# Altium project BatteryManagementSystem.PrjPcb
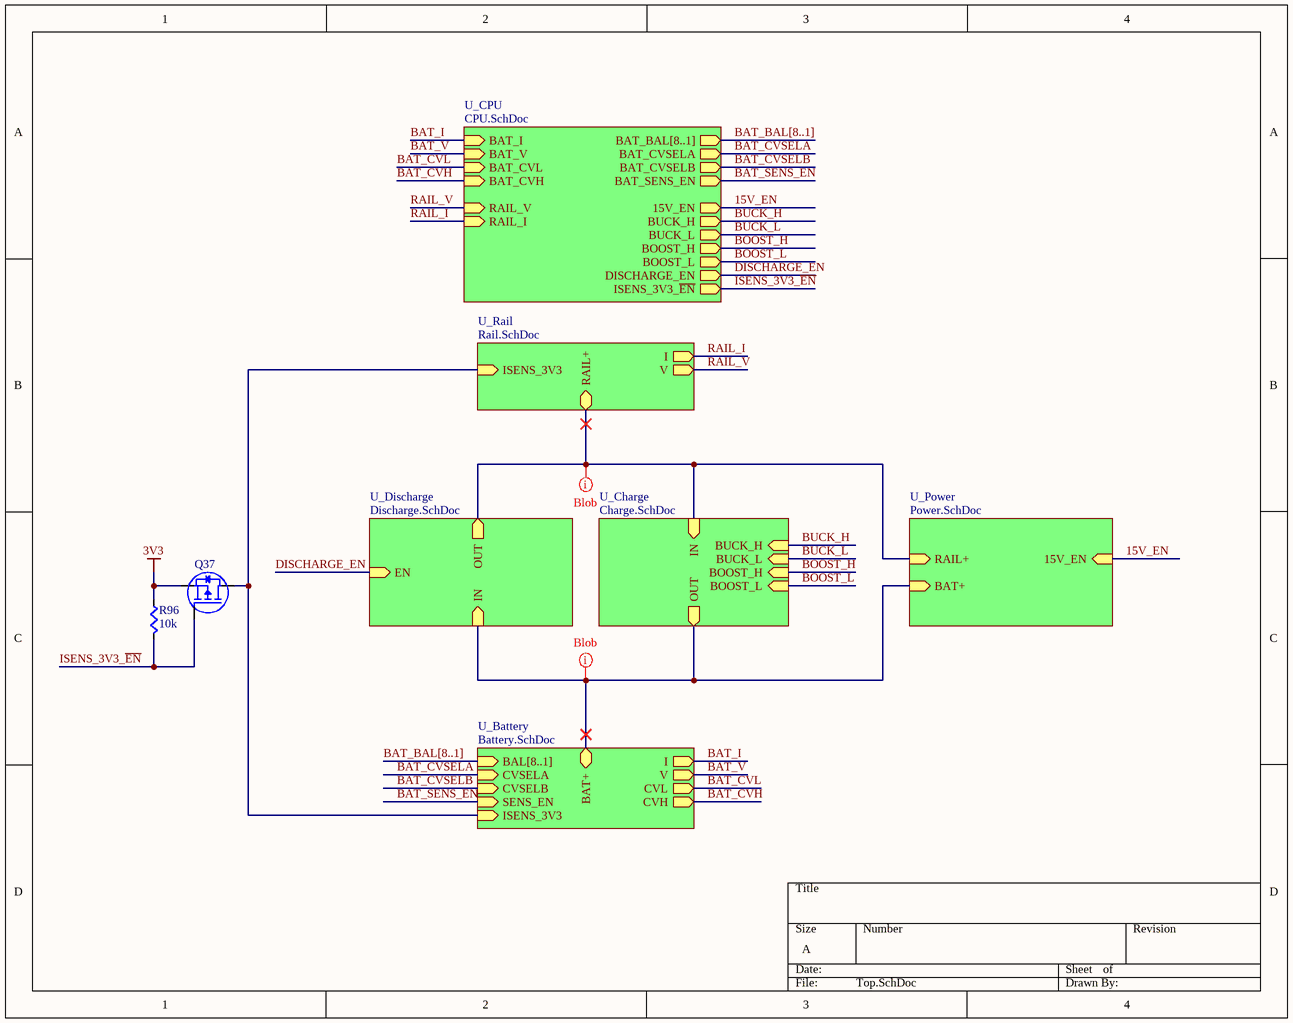
[diagram p0: Top.SchDoc]
7 sheets, 230 parts. Net scope: hierarchical (ports join the sheet entries above them; power ports are global).
Board files: BatteryManagementSystem.PcbDoc, BatteryManagementSystem2.PcbDoc
Sheets:
  Top.SchDoc
    U_Battery = Battery.SchDoc
    U_Rail = Rail.SchDoc
    U_Power = Power.SchDoc
    U_Discharge = Discharge.SchDoc
    U_Charge = Charge.SchDoc
    U_CPU = CPU.SchDoc

## Sheet Top.SchDoc
size A

### Parts
Q37  FDN5618P  [PowerSOT-3]  (value not drawn)
R96  value 10k  [RES0603]  (hidden comment: Res)

### Sub-sheets
U_Battery = Battery.SchDoc: V (out), BAT+ (bidir), I (out), BAL[8..1] (in), CVL (out), CVH (out), CVSELA (in), CVSELB (in), SENS_EN (in), ISENS_3V3 (in)
U_Charge = Charge.SchDoc: BOOST_L (in), BOOST_H (in), OUT (out), BUCK_L (in), BUCK_H (in), IN (in)
U_CPU = CPU.SchDoc: BAT_I (in), BAT_V (in), BAT_CVL (in), BAT_CVH (in), RAIL_V (in), RAIL_I (in), BAT_BAL[8..1] (out), BUCK_L (out), BUCK_H (out), BOOST_L (out), BOOST_H (out), BAT_CVSELA (out), BAT_CVSELB (out), DISCHARGE_EN (out), BAT_SENS_EN (out), 15V_EN (out), ISENS_3V3_~{EN} (out)
U_Discharge = Discharge.SchDoc: EN (in), IN (in), OUT (out)
U_Power = Power.SchDoc: 15V_EN (in), RAIL+ (in), BAT+ (in)
U_Rail = Rail.SchDoc: I (out), V (out), RAIL+ (bidir), ISENS_3V3 (in)

### Nets
3V3: Q37.S R96.1(A)
15V_EN: sheet U_Power/15V_EN, sheet U_CPU/15V_EN
BAT+: sheet U_Battery/BAT+, sheet U_Power/BAT+, sheet U_Discharge/IN, sheet U_Charge/OUT
BAT_CVH: sheet U_Battery/CVH, sheet U_CPU/BAT_CVH
BAT_CVL: sheet U_Battery/CVL, sheet U_CPU/BAT_CVL
BAT_CVSELA: sheet U_Battery/CVSELA, sheet U_CPU/BAT_CVSELA
BAT_CVSELB: sheet U_Battery/CVSELB, sheet U_CPU/BAT_CVSELB
BAT_I: sheet U_Battery/I, sheet U_CPU/BAT_I
BAT_SENS_EN: sheet U_Battery/SENS_EN, sheet U_CPU/BAT_SENS_EN
BAT_V: sheet U_Battery/V, sheet U_CPU/BAT_V
BOOST_H: sheet U_Charge/BOOST_H, sheet U_CPU/BOOST_H
BOOST_L: sheet U_Charge/BOOST_L, sheet U_CPU/BOOST_L
BUCK_H: sheet U_Charge/BUCK_H, sheet U_CPU/BUCK_H
BUCK_L: sheet U_Charge/BUCK_L, sheet U_CPU/BUCK_L
DISCHARGE_EN: sheet U_Discharge/EN, sheet U_CPU/DISCHARGE_EN
ISENS_3V3_~{EN}: Q37.G R96.2(B) ; sheet U_CPU/ISENS_3V3_~{EN}
RAIL+: sheet U_Rail/RAIL+, sheet U_Power/RAIL+, sheet U_Discharge/OUT, sheet U_Charge/IN
RAIL_I: sheet U_Rail/I, sheet U_CPU/RAIL_I
RAIL_V: sheet U_Rail/V, sheet U_CPU/RAIL_V
NetC1_1: Q37.D ; sheet U_Battery/ISENS_3V3, sheet U_Rail/ISENS_3V3

### Buses and harness runs
bus BAT_BAL[8..1] = sheet U_Battery/BAL[8..1]
bus BAT_BAL[8..1] = sheet U_CPU/BAT_BAL[8..1]

### Layout directives
net class Blob: BAT+, RAIL+

### Library data of the parts
Q37 = FDN5618P: 60V P-Channel Logic Level PowerTrench MOSFET; Supplier 1: Digi-Key; Supplier Part Number 1: FDN5618PCT-ND
R96 = Res: Supplier 1: Digi-Key; Supplier Part Number 1: RMCF0603JT10K0CT-ND

## Sheet Battery.SchDoc
size A3 portrait
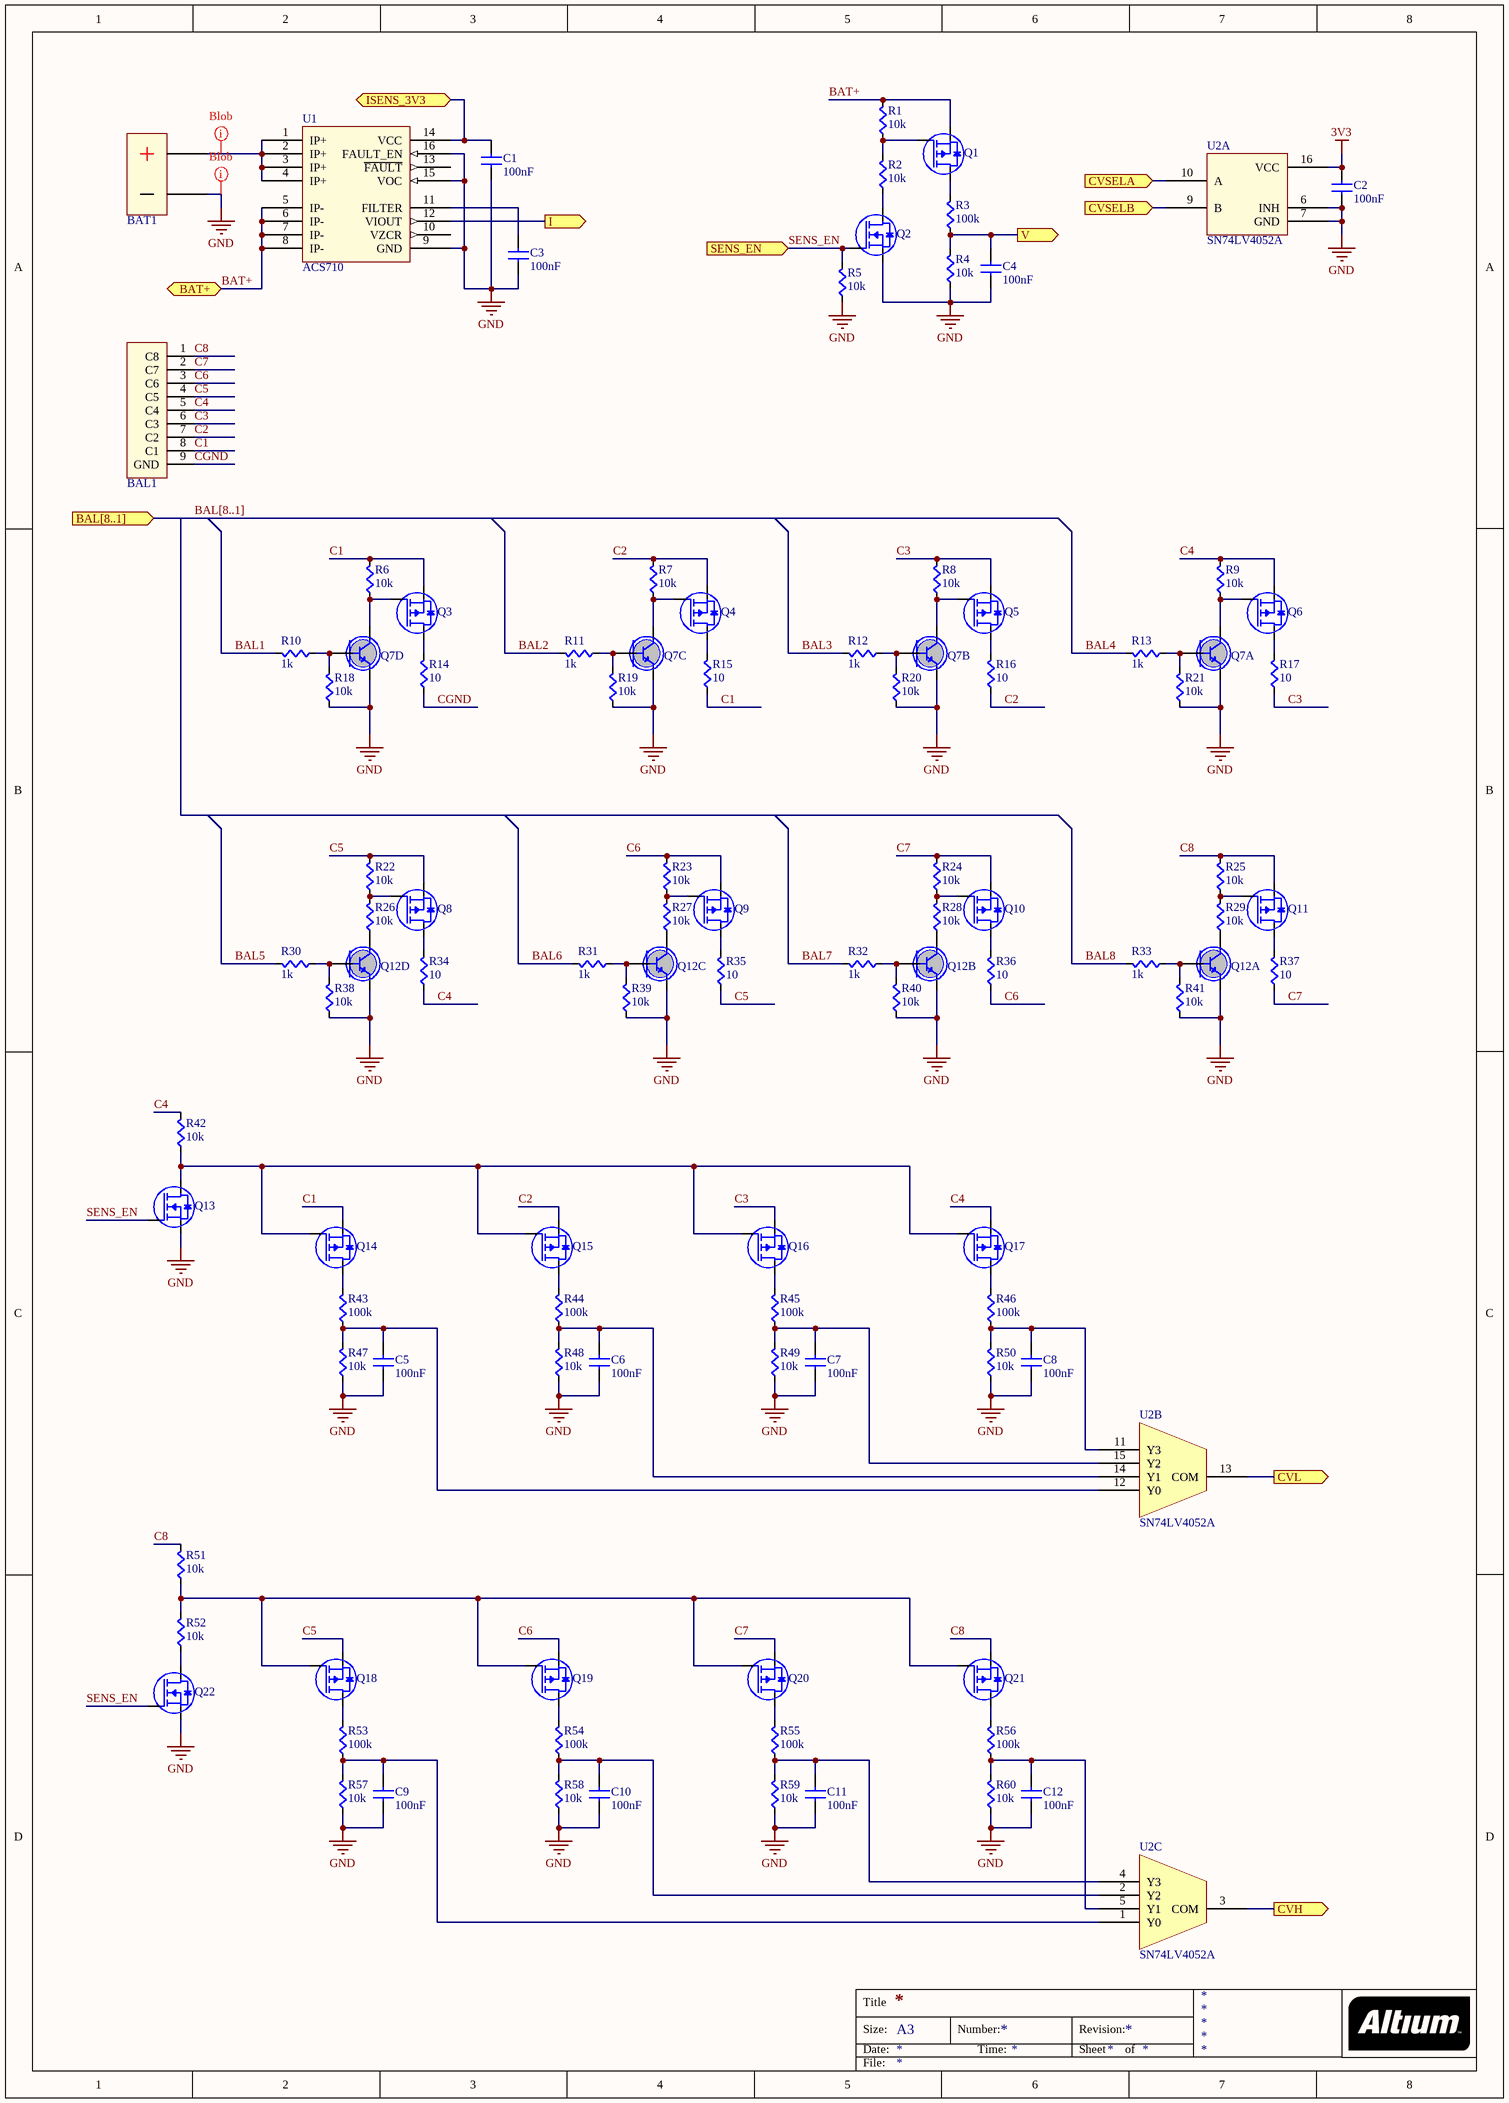
[diagram p1: Battery.SchDoc]

### Parts
BAL1  JST1x9  [JST1x9]  (value not drawn)
BAT1  BATWIRE  [BATWIRE12]  (value not drawn)
C1  value 100nF  [CAPC0603]  (hidden comment: Cap)
C2  value 100nF  [CAPC0603]  (hidden comment: Cap)
C3  value 100nF  [CAPC0603]  (hidden comment: Cap)
C4  value 100nF  [CAPC0603]  (hidden comment: Cap)
C5  value 100nF  [CAPC0603]  (hidden comment: Cap)
C6  value 100nF  [CAPC0603]  (hidden comment: Cap)
C7  value 100nF  [CAPC0603]  (hidden comment: Cap)
C8  value 100nF  [CAPC0603]  (hidden comment: Cap)
C9  value 100nF  [CAPC0603]  (hidden comment: Cap)
C10  value 100nF  [CAPC0603]  (hidden comment: Cap)
C11  value 100nF  [CAPC0603]  (hidden comment: Cap)
C12  value 100nF  [CAPC0603]  (hidden comment: Cap)
Q1  FDN5618P  [PowerSOT-3]  (value not drawn)
Q2  FDN5630  [PowerSOT-3]  (value not drawn)
Q3  FDN5618P  [PowerSOT-3]  (value not drawn)
Q4  FDN5618P  [PowerSOT-3]  (value not drawn)
Q5  FDN5618P  [PowerSOT-3]  (value not drawn)
Q6  FDN5618P  [PowerSOT-3]  (value not drawn)
Q7  MMPQ2222A  [MMPQ2222A]  (value not drawn)  (parts A,B,C,D of 4)
Q8  FDN5618P  [PowerSOT-3]  (value not drawn)
Q9  FDN5618P  [PowerSOT-3]  (value not drawn)
Q10  FDN5618P  [PowerSOT-3]  (value not drawn)
Q11  FDN5618P  [PowerSOT-3]  (value not drawn)
Q12  MMPQ2222A  [MMPQ2222A]  (value not drawn)  (parts A,B,C,D of 4)
Q13  FDN5630  [PowerSOT-3]  (value not drawn)
Q14  FDN5618P  [PowerSOT-3]  (value not drawn)
Q15  FDN5618P  [PowerSOT-3]  (value not drawn)
Q16  FDN5618P  [PowerSOT-3]  (value not drawn)
Q17  FDN5618P  [PowerSOT-3]  (value not drawn)
Q18  FDN5618P  [PowerSOT-3]  (value not drawn)
Q19  FDN5618P  [PowerSOT-3]  (value not drawn)
Q20  FDN5618P  [PowerSOT-3]  (value not drawn)
Q21  FDN5618P  [PowerSOT-3]  (value not drawn)
Q22  FDN5630  [PowerSOT-3]  (value not drawn)
R1  value 10k  [RES0603]  (hidden comment: Res)
R2  value 10k  [RES0603]  (hidden comment: Res)
R3  value 100k  [RES0603]  (hidden comment: Res)
R4  value 10k  [RES0603]  (hidden comment: Res)
R5  value 10k  [RES0603]  (hidden comment: Res)
R6  value 10k  [RES0603]  (hidden comment: Res)
R7  value 10k  [RES0603]  (hidden comment: Res)
R8  value 10k  [RES0603]  (hidden comment: Res)
R9  value 10k  [RES0603]  (hidden comment: Res)
R10  value 1k  [RES0603]  (hidden comment: Res)
R11  value 1k  [RES0603]  (hidden comment: Res)
R12  value 1k  [RES0603]  (hidden comment: Res)
R13  value 1k  [RES0603]  (hidden comment: Res)
R14  value 10  [FMP200]  (hidden comment: Res)
R15  value 10  [FMP200]  (hidden comment: Res)
R16  value 10  [FMP200]  (hidden comment: Res)
R17  value 10  [FMP200]  (hidden comment: Res)
R18  value 10k  [RES0603]  (hidden comment: Res)
R19  value 10k  [RES0603]  (hidden comment: Res)
R20  value 10k  [RES0603]  (hidden comment: Res)
R21  value 10k  [RES0603]  (hidden comment: Res)
R22  value 10k  [RES0603]  (hidden comment: Res)
R23  value 10k  [RES0603]  (hidden comment: Res)
R24  value 10k  [RES0603]  (hidden comment: Res)
R25  value 10k  [RES0603]  (hidden comment: Res)
R26  value 10k  [RES0603]  (hidden comment: Res)
R27  value 10k  [RES0603]  (hidden comment: Res)
R28  value 10k  [RES0603]  (hidden comment: Res)
R29  value 10k  [RES0603]  (hidden comment: Res)
R30  value 1k  [RES0603]  (hidden comment: Res)
R31  value 1k  [RES0603]  (hidden comment: Res)
R32  value 1k  [RES0603]  (hidden comment: Res)
R33  value 1k  [RES0603]  (hidden comment: Res)
R34  value 10  [FMP200]  (hidden comment: Res)
R35  value 10  [FMP200]  (hidden comment: Res)
R36  value 10  [FMP200]  (hidden comment: Res)
R37  value 10  [FMP200]  (hidden comment: Res)
R38  value 10k  [RES0603]  (hidden comment: Res)
R39  value 10k  [RES0603]  (hidden comment: Res)
R40  value 10k  [RES0603]  (hidden comment: Res)
R41  value 10k  [RES0603]  (hidden comment: Res)
R42  value 10k  [RES0603]  (hidden comment: Res)
R43  value 100k  [RES0603]  (hidden comment: Res)
R44  value 100k  [RES0603]  (hidden comment: Res)
R45  value 100k  [RES0603]  (hidden comment: Res)
R46  value 100k  [RES0603]  (hidden comment: Res)
R47  value 10k  [RES0603]  (hidden comment: Res)
R48  value 10k  [RES0603]  (hidden comment: Res)
R49  value 10k  [RES0603]  (hidden comment: Res)
R50  value 10k  [RES0603]  (hidden comment: Res)
R51  value 10k  [RES0603]  (hidden comment: Res)
R52  value 10k  [RES0603]  (hidden comment: Res)
R53  value 100k  [RES0603]  (hidden comment: Res)
R54  value 100k  [RES0603]  (hidden comment: Res)
R55  value 100k  [RES0603]  (hidden comment: Res)
R56  value 100k  [RES0603]  (hidden comment: Res)
R57  value 10k  [RES0603]  (hidden comment: Res)
R58  value 10k  [RES0603]  (hidden comment: Res)
R59  value 10k  [RES0603]  (hidden comment: Res)
R60  value 10k  [RES0603]  (hidden comment: Res)
U1  ACS710  [ACS710_NOPIN]
U2  SN74LV4052A  [SN74LV4052AD]  (parts A,B,C of 3)

### Ports
BAL[8..1] (in), BAT+ (bidir), CVH (out), CVL (out), CVSELA (in), CVSELB (in), I (out), ISENS_3V3, SENS_EN (in), V (out)

### Nets
3V3: C2.1(A) U2.16(VCC)
GND: BAT1.- C1.2(B) C2.2(B) C3.2(B) C4.2(B) C5.2(B) C6.2(B) C7.2(B) C8.2(B) C9.2(B) C10.2(B) C11.2(B) C12.2(B) Q2.S Q7.10(E4) Q7.12(E3) Q7.14(E2) Q7.16(E1) Q12.10(E4) Q12.12(E3) Q12.14(E2) Q12.16(E1) Q13.S Q22.S R4.2(B) R5.2(B) R18.2(B) R19.2(B) R20.2(B) R21.2(B) R38.2(B) R39.2(B) R40.2(B) R41.2(B) R47.2(B) R48.2(B) R49.2(B) R50.2(B) R57.2(B) R58.2(B) R59.2(B) R60.2(B) U1.9(GND) U1.15(VOC) U1.16(FAULT_EN) U2.6(INH) U2.7(GND)
BAL1: R10.1(A)
BAL2: R11.1(A)
BAL3: R12.1(A)
BAL4: R13.1(A)
BAL5: R30.1(A)
BAL6: R31.1(A)
BAL7: R32.1(A)
BAL8: R33.1(A)
BAT+: Q1.S R1.1(A) U1.5(IP-) U1.6(IP-) U1.7(IP-) U1.8(IP-) ; port BAT+
BAT_CVH: U2.3(COM) ; port CVH
BAT_CVL: U2.13(COM) ; port CVL
BAT_CVSELA: U2.10(A) ; port CVSELA
BAT_CVSELB: U2.9(B) ; port CVSELB
BAT_I: U1.12(VIOUT) ; port I
BAT_V: C4.1(A) R3.2(B) R4.1(A) ; port V
C1: BAL1.8(C1) Q3.S Q14.S R6.1(A) R15.2(B)
C2: BAL1.7(C2) Q4.S Q15.S R7.1(A) R16.2(B)
C3: BAL1.6(C3) Q5.S Q16.S R8.1(A) R17.2(B)
C4: BAL1.5(C4) Q6.S Q17.S R9.1(A) R34.2(B) R42.1(A)
C5: BAL1.4(C5) Q8.S Q18.S R22.1(A) R35.2(B)
C6: BAL1.3(C6) Q9.S Q19.S R23.1(A) R36.2(B)
C7: BAL1.2(C7) Q10.S Q20.S R24.1(A) R37.2(B)
C8: BAL1.1(C8) Q11.S Q21.S R25.1(A) R51.1(A)
CGND: BAL1.9(GND) R14.2(B)
SENS_EN: Q2.G Q13.G Q22.G R5.1(A) ; port SENS_EN  [project net BAT_SENS_EN]
NetBAT1_+: BAT1.+ U1.1(IP+) U1.2(IP+) U1.3(IP+) U1.4(IP+)
NetC1_1: C1.1(A) U1.14(VCC) ; port ISENS_3V3
NetC3_1: C3.1(A) U1.11(FILTER)
NetC5_1: C5.1(A) R43.2(B) R47.1(A) U2.12(Y0)
NetC6_1: C6.1(A) R44.2(B) R48.1(A) U2.14(Y1)
NetC7_1: C7.1(A) R45.2(B) R49.1(A) U2.15(Y2)
NetC8_1: C8.1(A) R46.2(B) R50.1(A) U2.11(Y3)
NetC9_1: C9.1(A) R53.2(B) R57.1(A) U2.1(Y0)
NetC10_1: C10.1(A) R54.2(B) R58.1(A) U2.2(Y2)
NetC11_1: C11.1(A) R55.2(B) R59.1(A) U2.4(Y3)
NetC12_1: C12.1(A) R56.2(B) R60.1(A) U2.5(Y1)
NetQ1_D: Q1.D R3.1(A)
NetQ1_G: Q1.G R1.2(B) R2.1(A)
NetQ2_D: Q2.D R2.2(B)
NetQ3_D: Q3.D R14.1(A)
NetQ3_G: Q3.G Q7.7(C4) R6.2(B)
NetQ4_D: Q4.D R15.1(A)
NetQ4_G: Q4.G Q7.5(C3) R7.2(B)
NetQ5_D: Q5.D R16.1(A)
NetQ5_G: Q5.G Q7.3(C2) R8.2(B)
NetQ6_D: Q6.D R17.1(A)
NetQ6_G: Q6.G Q7.1(C1) R9.2(B)
NetQ7_9: Q7.9(B4) R10.2(B) R18.1(A)
NetQ7_11: Q7.11(B3) R11.2(B) R19.1(A)
NetQ7_13: Q7.13(B2) R12.2(B) R20.1(A)
NetQ7_15: Q7.15(B1) R13.2(B) R21.1(A)
NetQ8_D: Q8.D R34.1(A)
NetQ8_G: Q8.G R22.2(B) R26.1(A)
NetQ9_D: Q9.D R35.1(A)
NetQ9_G: Q9.G R23.2(B) R27.1(A)
NetQ10_D: Q10.D R36.1(A)
NetQ10_G: Q10.G R24.2(B) R28.1(A)
NetQ11_D: Q11.D R37.1(A)
NetQ11_G: Q11.G R25.2(B) R29.1(A)
NetQ12_1: Q12.1(C1) R29.2(B)
NetQ12_3: Q12.3(C2) R28.2(B)
NetQ12_5: Q12.5(C3) R27.2(B)
NetQ12_7: Q12.7(C4) R26.2(B)
NetQ12_9: Q12.9(B4) R30.2(B) R38.1(A)
NetQ12_11: Q12.11(B3) R31.2(B) R39.1(A)
NetQ12_13: Q12.13(B2) R32.2(B) R40.1(A)
NetQ12_15: Q12.15(B1) R33.2(B) R41.1(A)
NetQ13_D: Q13.D Q14.G Q15.G Q16.G Q17.G R42.2(B)
NetQ14_D: Q14.D R43.1(A)
NetQ15_D: Q15.D R44.1(A)
NetQ16_D: Q16.D R45.1(A)
NetQ17_D: Q17.D R46.1(A)
NetQ18_D: Q18.D R53.1(A)
NetQ18_G: Q18.G Q19.G Q20.G Q21.G R51.2(B) R52.1(A)
NetQ19_D: Q19.D R54.1(A)
NetQ20_D: Q20.D R55.1(A)
NetQ21_D: Q21.D R56.1(A)
NetQ22_D: Q22.D R52.2(B)

Not connected (* = marked no-connect by the designer): U1 10(VZCR) 13(~{FAULT})

### Buses and harness runs
bus BAL[8..1] = port BAL[8..1]

### Layout directives
net class Blob: GND, NetBAT1_+

### Notes on the sheet
- Title
- Size:
- Date:
- A3
- Number:
- Time:
- Revision:
- Sheet
- of
- File:

### Library data of the parts
BAT1 = BATWIRE: Two large gauge leads soldered directly to the board.
Q1 Q3-Q6 Q8-Q11 Q14-Q21 = FDN5618P: as Q37 on sheet Top; Supplier 1: Digi-Key; Supplier Part Number 1: FDN5618PCT-ND
Q2 Q13 Q22 = FDN5630: 60V N-Channel PowerTrench MOSFET; Supplier 1: Digi-Key; Supplier Part Number 1: FDN5630CT-ND
Q7 Q12 = MMPQ2222A: Quad NPN General Purpose Amplifier; Supplier 1: Digi-Key; Supplier Part Number 1: MMPQ2222ACT-ND
U1 = ACS710: Current Sensor with Integrated Overcurrent Detection; Supplier 1: Digi-Key; Supplier Part Number 1: 620-1334-1-ND
U2 = SN74LV4052A: Dual 4-Channel Analog Multiplexers/Demultiplexers; Supplier 1: Digi-Key; Supplier Part Number 1: 296-16707-1-ND
BAL1 = JST1x9: Supplier 1: Digi-Key; Supplier Part Number 1: 455-2224-ND
C1-C12 = Cap: Supplier 1: Digi-Key; Supplier Part Number 1: 1276-1000-1-ND
R1-R60 = Res: Supplier 1: Digi-Key
  R1 R2 R6-R9 R18-R29 R38-R42 R51 R52: Supplier Part Number 1: RMCF0603JT10K0CT-ND
  R3 R43-R46 R53-R56: Supplier Part Number 1: RR08P100KDCT-ND
  R4 R5 R47-R50 R57-R60: Supplier Part Number 1: RR08P10.0KDCT-ND
  R10-R13 R30-R33: Supplier Part Number 1: RHM1.0KGCT-ND
  R14-R17 R34-R37: Supplier Part Number 1: 10ZCT-ND

## Sheet Rail.SchDoc
size A
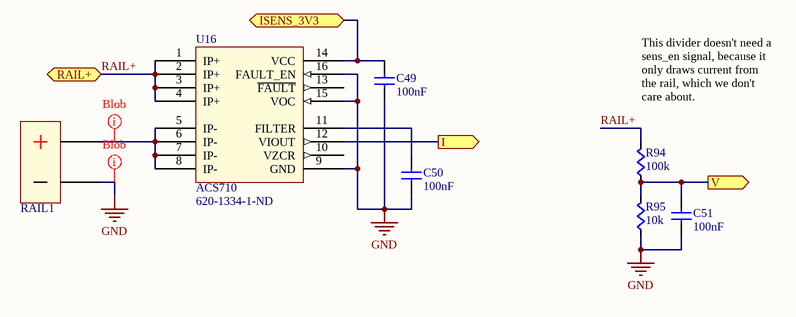
[diagram p2: Rail.SchDoc]

### Parts
C49  value 100nF  [CAPC0603]  (hidden comment: Cap)
C50  value 100nF  [CAPC0603]  (hidden comment: Cap)
C51  value 100nF  [CAPC0603]  (hidden comment: Cap)
R94  value 100k  [RES0603]  (hidden comment: Res)
R95  value 10k  [RES0603]  (hidden comment: Res)
RAIL1  BATWIRE  [BATWIRE12]  (value not drawn)
U16  ACS710  Supplier Part Number 1: 620-1334-1-ND  [ACS710]

### Ports
I (out), ISENS_3V3, RAIL+ (bidir), V (out)

### Nets
GND: C49.2(B) C50.2(B) C51.2(B) R95.2(B) RAIL1.- U16.9(GND) U16.15(VOC) U16.16(FAULT_EN)
RAIL+: R94.1(A) U16.1(IP+) U16.2(IP+) U16.3(IP+) U16.4(IP+) ; port RAIL+
RAIL_I: U16.12(VIOUT) ; port I
RAIL_V: C51.1(A) R94.2(B) R95.1(A) ; port V
NetC1_1: C49.1(A) U16.14(VCC) ; port ISENS_3V3
NetC50_1: C50.1(A) U16.11(FILTER)
NetRAIL1_+: RAIL1.+ U16.5(IP-) U16.6(IP-) U16.7(IP-) U16.8(IP-)

Not connected (* = marked no-connect by the designer): U16 10(VZCR) 13(~{FAULT})

### Layout directives
net class Blob: GND, NetRAIL1_+

### Notes on the sheet
- (near R94) This divider doesn't need a sens_en signal, because it only draws current from the rail, which we don't care about.

### Library data of the parts
RAIL1 = BATWIRE: as BAT1 on sheet Battery
U16 = ACS710: as U1 on sheet Battery; Supplier 1: Digi-Key
C49-C51 = Cap: Supplier 1: Digi-Key; Supplier Part Number 1: 1276-1000-1-ND
R94 R95 = Res: Supplier 1: Digi-Key
  R94: Supplier Part Number 1: RR08P100KDCT-ND
  R95: Supplier Part Number 1: RR08P10.0KDCT-ND

## Sheet Power.SchDoc
size A4
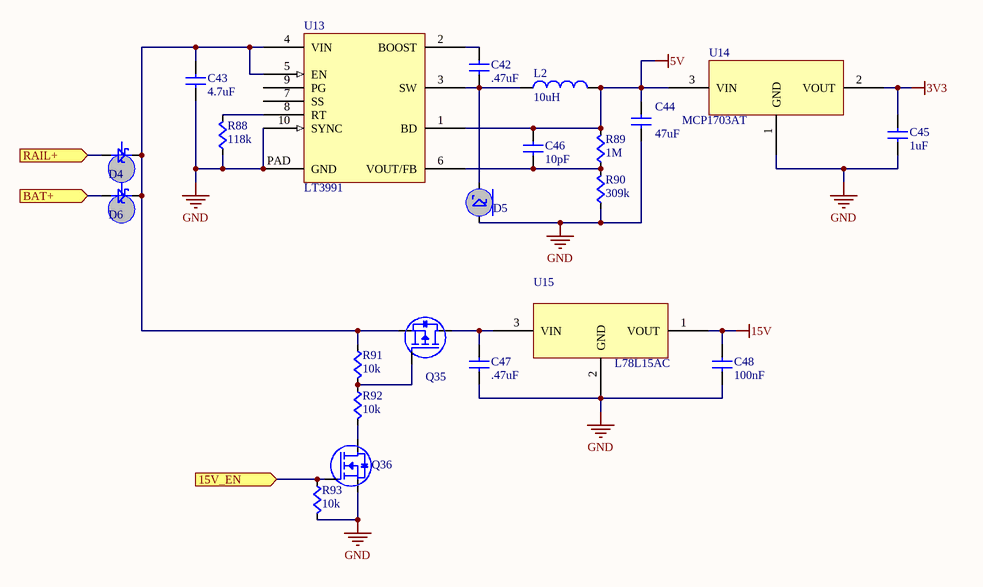
[diagram p3: Power.SchDoc]

### Parts
C42  value .47uF  [CAPC0603]  (hidden comment: Cap)
C43  value 4.7uF  [CAPC0805]  (hidden comment: Cap)
C44  value 47uF  [CAPC1206]  (hidden comment: Cap)
C45  value 1uF  [CAPC0603]  (hidden comment: Cap)
C46  value 10pF  [CAPC0603]  (hidden comment: Cap)
C47  value .47uF  [CAPC0603]  (hidden comment: Cap)
C48  value 100nF  [CAPC0603]  (hidden comment: Cap)
D4  DFLS160  [POWERDI123]  (value not drawn)
D5  DFLS160  [POWERDI123]  (value not drawn)
D6  DFLS160  [POWERDI123]  (value not drawn)
L2  Inductance: 10uH  [CDPH4D19F]  (hidden comment: Inductor)
Q35  FDN5618P  [PowerSOT-3]  (value not drawn)
Q36  FDN5630  [PowerSOT-3]  (value not drawn)
R88  value 118k  [RES0603]  (hidden comment: Res)
R89  value 1M  [RES0603]  (hidden comment: Res)
R90  value 309k  [RES0603]  (hidden comment: Res)
R91  value 10k  [RES0603]  (hidden comment: Res)
R92  value 10k  [RES0603]  (hidden comment: Res)
R93  value 10k  [RES0603]  (hidden comment: Res)
U13  LT3991  [LTS3991MSE]
U14  MCP1703AT  [MCP1703AT-xx02EMB]
U15  L78L15AC  [L78LxxAxUTR]

### Ports
15V_EN (in), BAT+ (in), RAIL+ (in)

### Nets
3V3: C45.1(A) U14.2(VOUT)
5V: C44.1(A) C46.2(B) L2.2(B) R89.1(A) U13.1(BD) U14.3(VIN)
15V: C48.1(A) U15.1(VOUT)
GND: C43.2(B) C44.2(B) C45.2(B) C47.2(B) C48.2(B) D5.A Q36.S R88.2(B) R90.2(B) R93.2(B) U13.10(SYNC) U13.PAD(GND) U14.1(GND) U15.2(GND)
15V_EN: Q36.G R93.1(A) ; port 15V_EN
BAT+: D6.A ; port BAT+
RAIL+: D4.A ; port RAIL+
NetC42_1: C42.1(A) U13.2(BOOST)
NetC42_2: C42.2(B) D5.C L2.1(A) U13.3(SW)
NetC43_1: C43.1(A) D4.C D6.C Q35.S R91.2(B) U13.4(VIN) U13.5(EN)
NetC46_1: C46.1(A) R89.2(B) R90.1(A) U13.6(VOUT/FB)
NetC47_1: C47.1(A) Q35.D U15.3(VIN)
NetQ35_G: Q35.G R91.1(A) R92.2(B)
NetQ36_D: Q36.D R92.1(A)
NetR88_1: R88.1(A) U13.8(RT)

Not connected (* = marked no-connect by the designer): U13 7(SS) 9(PG)

### Library data of the parts
D4-D6 = DFLS160: 1.0A Surface Mount Schottky Barrier Rectifier; Supplier 1: Digi-Key; Supplier Part Number 1: DFLS160DICT-ND
Q35 = FDN5618P: as Q37 on sheet Top; Supplier 1: Digi-Key; Supplier Part Number 1: FDN5618PCT-ND
Q36 = FDN5630: 60V N-Channel PowerTrench MOSFET; Supplier 1: Digi-Key; Supplier Part Number 1: FDN5630CT-ND
U13 = LT3991: 55V, 1.2A Step-Down Regulator with 2.8uA Quiescent Current; Supplier 1: Digi-Key; Supplier Part Number 1: LT3991EMSE#PBF-ND
U14 = MCP1703AT: 250 mA, 16V, Low Quiescent Current LDO Regulator; pin to pad: 2>3 3>2; Supplier 1: Digi-Key; Supplier Part Number 1: MCP1703AT-3302E/MBTR-ND
U15 = L78LxxAx: Positive Voltage Regulator; Supplier 1: Digi-Key; Supplier Part Number 1: 497-7279-1-ND
C42-C48 = Cap: Supplier 1: Digi-Key
  C42 C47: Supplier Part Number 1: 445-7465-1-ND
  C43: Supplier Part Number 1: 1276-1248-1-ND
  C44: Supplier Part Number 1: 399-5508-1-ND
  C45: Supplier Part Number 1: 1276-1041-1-ND
  C46: Supplier Part Number 1: 478-5769-1-ND
  C48: Supplier Part Number 1: 1276-1000-1-ND
L2 = Inductor: Supplier 1: Digi-Key; Supplier Part Number 1: 308-1311-1-ND
R88-R93 = Res: Supplier 1: Digi-Key
  R88: Supplier Part Number 1: RMCF0603FT118KCT-ND
  R89: Supplier Part Number 1: 541-1.0MAYCT-ND
  R90: Supplier Part Number 1: RR08P309KDCT-ND
  R91-R93: Supplier Part Number 1: RMCF0603JT10K0CT-ND

## Sheet Discharge.SchDoc
size A
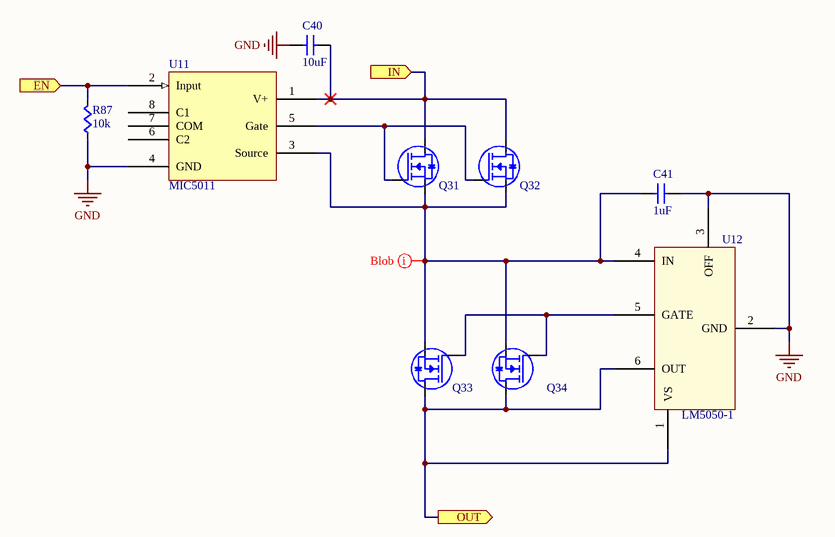
[diagram p4: Discharge.SchDoc]

### Parts
C40  value 10uF  [CAPC1206]  (hidden comment: Cap)
C41  value 1uF  [CAPC0805]  (hidden comment: Cap)
Q31  IRFB3306PbF  [TO-220AB Heatsink]  (value not drawn)
Q32  IRFB3306PbF  [TO-220AB Heatsink]  (value not drawn)
Q33  IRFB3306PbF  [TO-220AB Heatsink]  (value not drawn)
Q34  IRFB3306PbF  [TO-220AB Heatsink]  (value not drawn)
R87  value 10k  [RES0603]  (hidden comment: Res)
U11  MIC5011  [MIC5011]
U12  LM5050-1  [LM5050]

### Ports
EN (in), IN (in), OUT (out)

### Nets
GND: C40.1(A) C41.1(A) R87.2(B) U11.4(GND) U12.2(GND) U12.3(OFF)
BAT+: C40.2(B) Q31.D Q32.D U11.1(V+) ; port IN
DISCHARGE_EN: R87.1(A) U11.2(Input) ; port EN
RAIL+: Q33.D Q34.D U12.1(VS) U12.6(OUT) ; port OUT
NetC41_2: C41.2(B) Q31.S Q32.S Q33.S Q34.S U11.3(Source) U12.4(IN)
NetQ31_G: Q31.G Q32.G U11.5(Gate)
NetQ33_G: Q33.G Q34.G U12.5(GATE)

Not connected (* = marked no-connect by the designer): U11 6(C2) 7(COM) 8(C1)

### Layout directives
net class Blob: NetC41_2

### Library data of the parts
Q31-Q34 = IRFx3306PbF: HEXFET Power MOSFET; Heatsink: A10755-ND; Supplier 1: Digi-Key; Supplier Part Number 1: IRFB3306PBF-ND
U11 = MIC5011: Minimum Parts High- or Low-Side MOSFET Driver; Supplier 1: Digi-Key; Supplier Part Number 1: 576-1230-ND
U12 = LM5050: High-Side OR-ing FET Controller; Supplier 1: Digi-Key; Supplier Part Number 1: LM5050MK-1/NOPBCT-ND
C40 C41 = Cap: Supplier 1: Digi-Key
  C40: Supplier Part Number 1: 1276-2876-1-ND
  C41: Supplier Part Number 1: 1276-1029-1-ND
R87 = Res: Supplier 1: Digi-Key; Supplier Part Number 1: RMCF0603JT10K0CT-ND

## Sheet Charge.SchDoc
size A
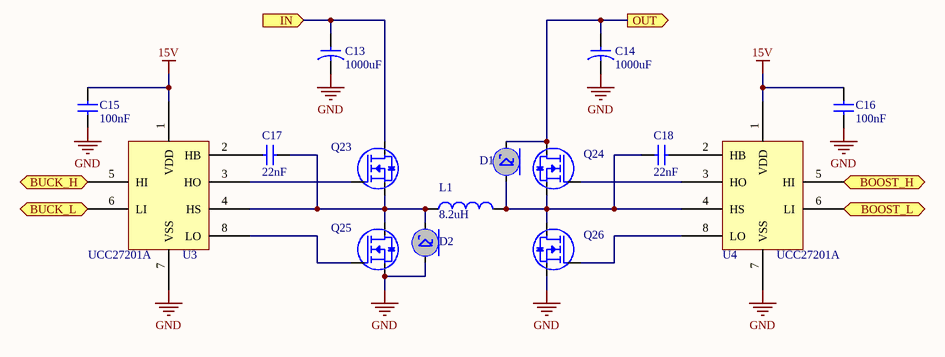
[diagram p5: Charge.SchDoc]

### Parts
C13  value 1000uF  [CAP1000uF]  (hidden comment: CapPol)
C14  value 1000uF  [CAP1000uF]  (hidden comment: CapPol)
C15  value 100nF  [CAPC0603]  (hidden comment: Cap)
C16  value 100nF  [CAPC0603]  (hidden comment: Cap)
C17  value 22nF  [CAPC0603]  (hidden comment: Cap)
C18  value 22nF  [CAPC0603]  (hidden comment: Cap)
D1  DFLS160  [POWERDI123]  (value not drawn)
D2  DFLS160  [POWERDI123]  (value not drawn)
L1  Inductance: 8.2uH  [IHLP-6767]  (hidden comment: Inductor)
Q23  IRFB3306PbF  [TO-220AB Heatsink]  (value not drawn)
Q24  IRFB3306PbF  [TO-220AB Heatsink]  (value not drawn)
Q25  IRFB3306PbF  [TO-220AB Heatsink]  (value not drawn)
Q26  IRFB3306PbF  [TO-220AB Heatsink]  (value not drawn)
U3  UCC27201A  [UCC27201A]
U4  UCC27201A  [UCC27201A]

### Ports
BOOST_H (in), BOOST_L (in), BUCK_H (in), BUCK_L (in), IN (in), OUT (out)

### Nets
15V: C15.1(A) C16.1(A) U3.1(VDD) U4.1(VDD)
GND: C13.2(B) C14.2(B) C15.2(B) C16.2(B) D2.A Q25.S Q26.S U3.7(VSS) U4.7(VSS)
BAT+: C14.1(A) D1.C Q24.D ; port OUT
BOOST_H: U4.5(HI) ; port BOOST_H
BOOST_L: U4.6(LI) ; port BOOST_L
BUCK_H: U3.5(HI) ; port BUCK_H
BUCK_L: U3.6(LI) ; port BUCK_L
RAIL+: C13.1(A) Q23.D ; port IN
NetC17_1: C17.1(A) D2.C L1.1(A) Q23.S Q25.D U3.4(HS)
NetC17_2: C17.2(B) U3.2(HB)
NetC18_1: C18.1(A) D1.A L1.2(B) Q24.S Q26.D U4.4(HS)
NetC18_2: C18.2(B) U4.2(HB)
NetQ23_G: Q23.G U3.3(HO)
NetQ24_G: Q24.G U4.3(HO)
NetQ25_G: Q25.G U3.8(LO)
NetQ26_G: Q26.G U4.8(LO)

### Library data of the parts
D1 D2 = DFLS160: as D4 on sheet Power; Supplier 1: Digi-Key; Supplier Part Number 1: DFLS160DICT-ND
Q23-Q26 = IRFx3306PbF: HEXFET Power MOSFET; Heatsink: A10755-ND; Supplier 1: Digi-Key; Supplier Part Number 1: IRFB3306PBF-ND
U3 U4 = UCC27201A: IC DVR HIGH/LOW SIDE 3A 8SOPWR; Supplier 1: Digi-Key; Supplier Part Number 1: 296-28428-1-ND
C13 C14 = CapPol: Supplier 1: Digi-Key; Supplier Part Number 1: 565-1618-ND
C15-C18 = Cap: Supplier 1: Digi-Key
  C15 C16: Supplier Part Number 1: 1276-1000-1-ND
  C17 C18: Supplier Part Number 1: 445-2275-1-ND
L1 = Inductor: Supplier 1: Digi-Key; Supplier Part Number 1: 541-1285-1-ND

## Sheet CPU.SchDoc
size A3
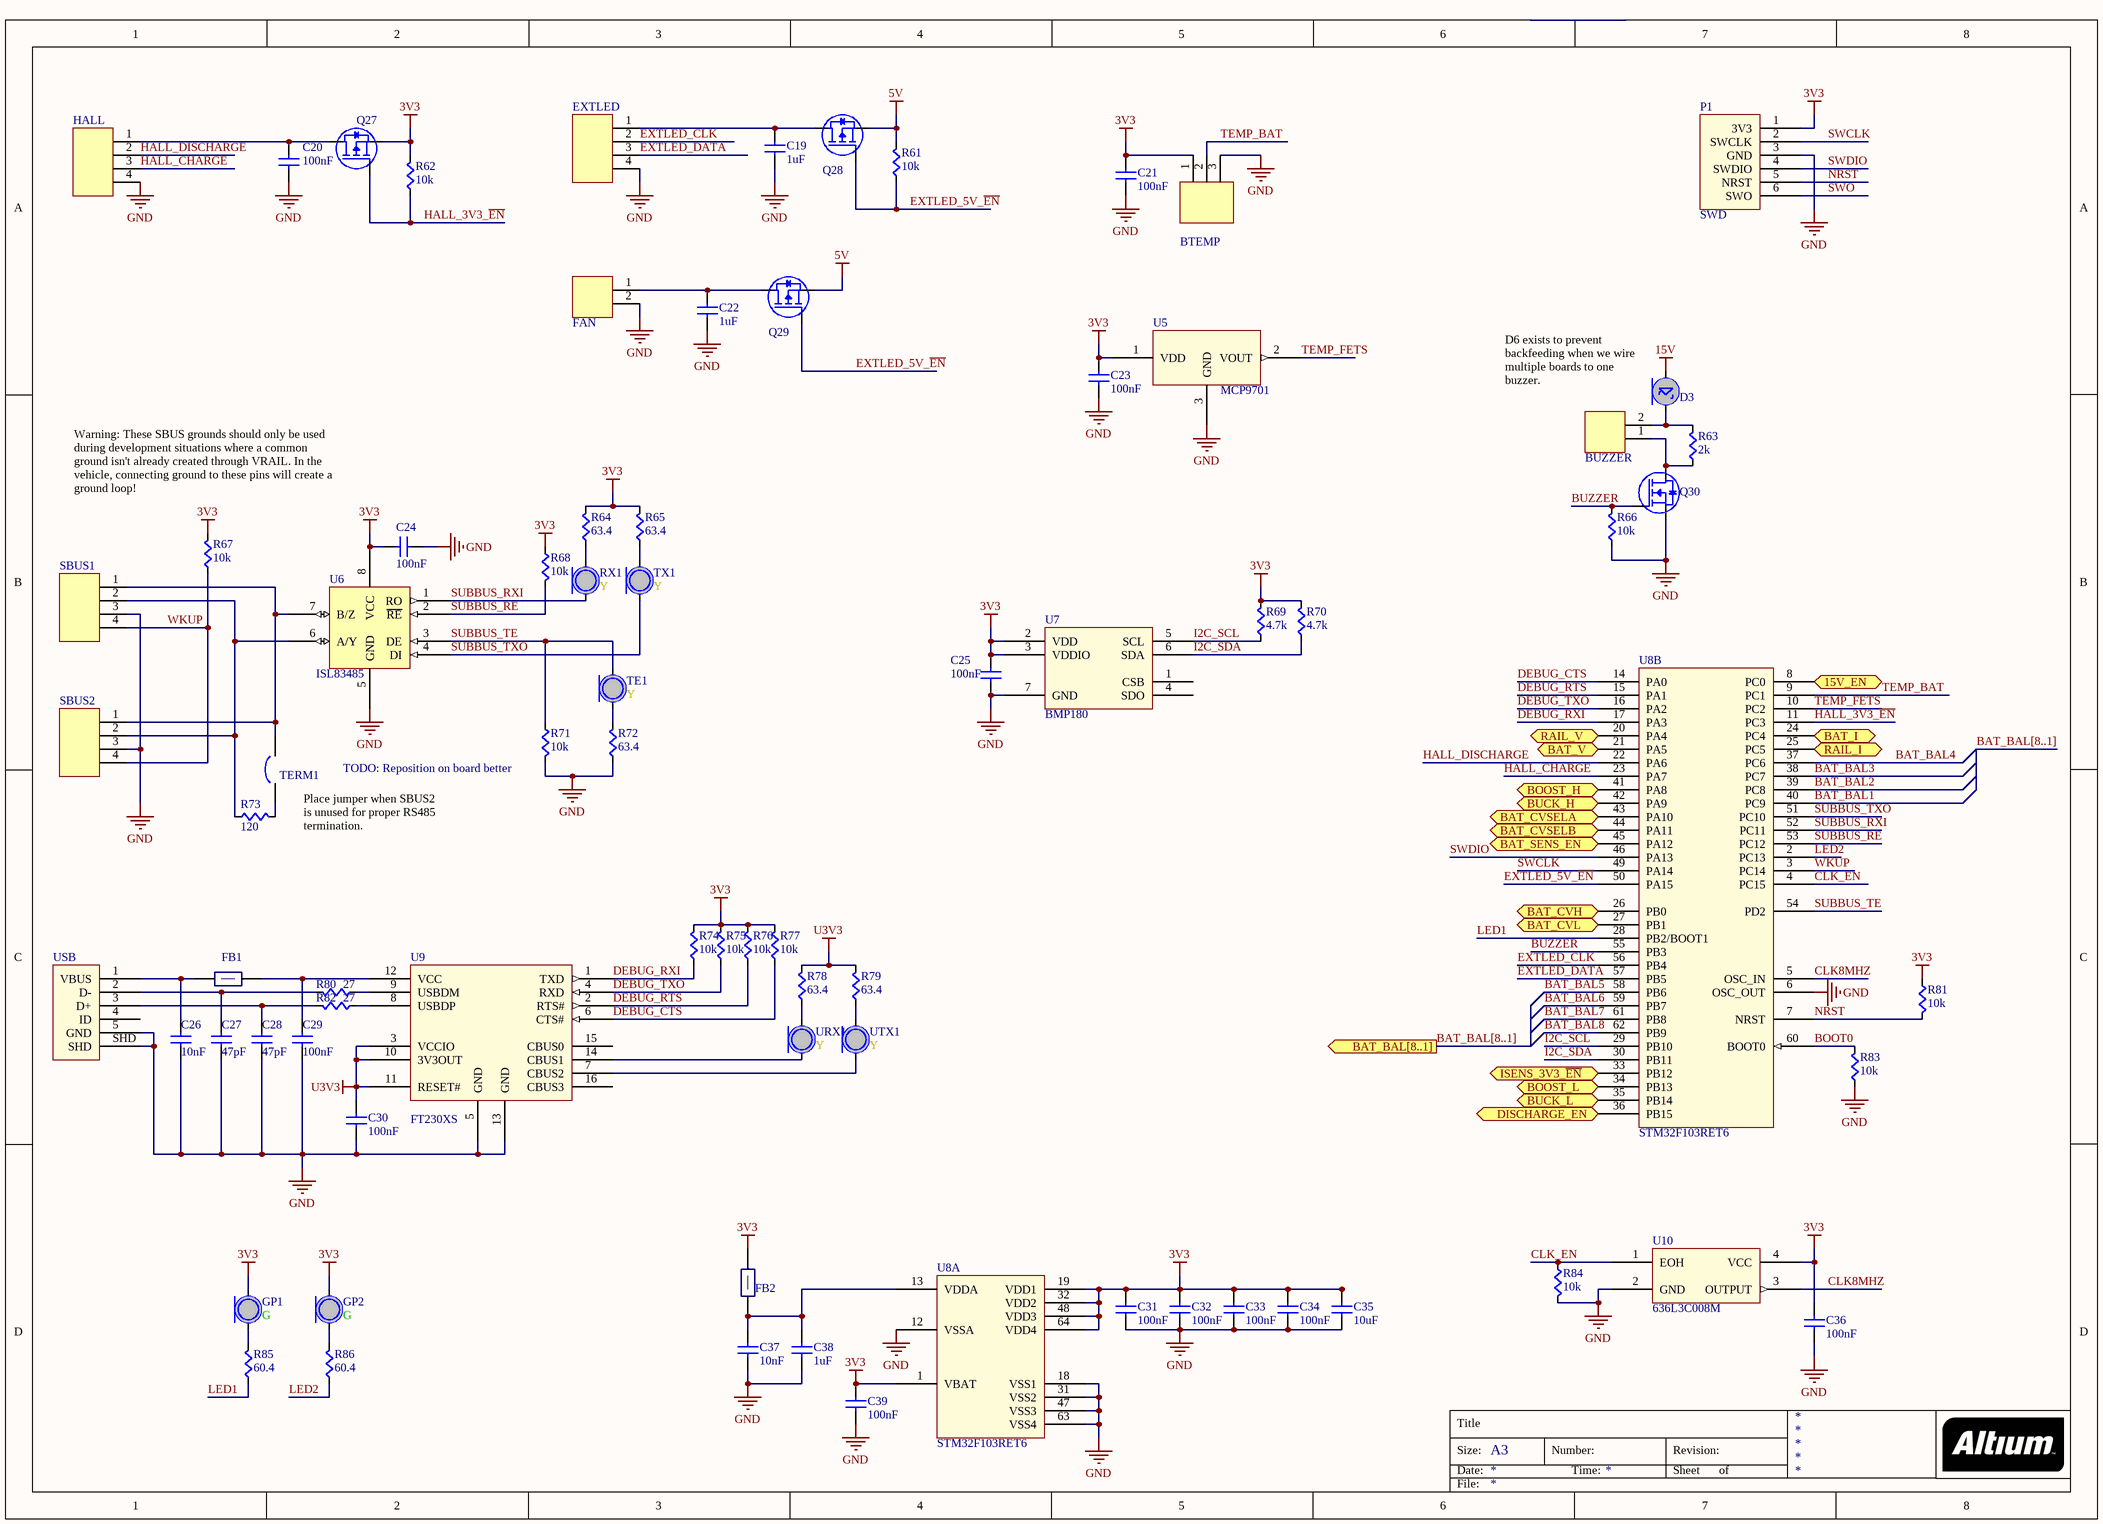
[diagram p6: CPU.SchDoc]

### Parts
BTEMP  3pos RA sherlock connector  [MOLEX-HDR-1X3-SHERLOCK-RA]  (value not drawn)
BUZZER  2-pin Horz Sherlock  [MOLEX-HDR-1X2-SHERLOCK-HORZ]  (value not drawn)
C19  value 1uF  [CAPC0805]  (hidden comment: Cap)
C20  value 100nF  [CAPC0603]  (hidden comment: Cap)
C21  value 100nF  [CAPC0603]  (hidden comment: Cap)
C22  value 1uF  [CAPC0805]  (hidden comment: Cap)
C23  value 100nF  [CAPC0603]  (hidden comment: Cap)
C24  value 100nF  [CAPC0603]  (hidden comment: Cap)
C25  value 100nF  [CAPC0603]  (hidden comment: Cap)
C26  value 10nF  [CAPC0603]  (hidden comment: Cap)
C27  value 47pF  [CAPC0603]  (hidden comment: Cap)
C28  value 47pF  [CAPC0603]  (hidden comment: Cap)
C29  value 100nF  [CAPC0603]  (hidden comment: Cap)
C30  value 100nF  [CAPC0603]  (hidden comment: Cap)
C31  value 100nF  [CAPC0603]  (hidden comment: Cap)
C32  value 100nF  [CAPC0603]  (hidden comment: Cap)
C33  value 100nF  [CAPC0603]  (hidden comment: Cap)
C34  value 100nF  [CAPC0603]  (hidden comment: Cap)
C35  value 10uF  [CAPC0603]  (hidden comment: Cap)
C36  value 100nF  [CAPC0603]  (hidden comment: Cap)
C37  value 10nF  [CAPC0603]  (hidden comment: Cap)
C38  value 1uF  [CAPC0805]  (hidden comment: Cap)
C39  value 100nF  [CAPC0603]  (hidden comment: Cap)
D3  DFLS160  [POWERDI123]  (value not drawn)
EXTLED  MOLEX-HDR-1x4-SHERLOCK_RA  [MOLEX-HDR-1X4-SHERLOCK-RA]  (value not drawn)
FAN  2-pin Vert Sherlock  [MOLEX-HDR-1X2-SHERLOCK-VERT]  (value not drawn)
FB1  FBead  [RES0603]  (value not drawn)
FB2  FBead  [RES0603]  (value not drawn)
GP1  Color: G  [LED0805]  (hidden comment: LED)
GP2  Color: G  [LED0805]  (hidden comment: LED)
HALL  MOLEX-HDR-1x4-SHERLOCK_VERT  [MOLEX-HDR-1X4-SHERLOCK-VERT]  (value not drawn)
P1  SWD  [SWD_STM32]
Q27  FDN5618P  [PowerSOT-3]  (value not drawn)
Q28  FDN5618P  [PowerSOT-3]  (value not drawn)
Q29  FDN5618P  [PowerSOT-3]  (value not drawn)
Q30  FDN5630  [PowerSOT-3]  (value not drawn)
R61  value 10k  [RES0603]  (hidden comment: Res)
R62  value 10k  [RES0603]  (hidden comment: Res)
R63  value 2k  [RES0603]  (hidden comment: Res)
R64  value 63.4  [RES0603]  (hidden comment: Res)
R65  value 63.4  [RES0603]  (hidden comment: Res)
R66  value 10k  [RES0603]  (hidden comment: Res)
R67  value 10k  [RES0603]  (hidden comment: Res)
R68  value 10k  [RES0603]  (hidden comment: Res)
R69  value 4.7k  [RES0603]  (hidden comment: Res)
R70  value 4.7k  [RES0603]  (hidden comment: Res)
R71  value 10k  [RES0603]  (hidden comment: Res)
R72  value 63.4  [RES0603]  (hidden comment: Res)
R73  value 120  [RES0603]  (hidden comment: Res)
R74  value 10k  [RES0603]  (hidden comment: Res)
R75  value 10k  [RES0603]  (hidden comment: Res)
R76  value 10k  [RES0603]  (hidden comment: Res)
R77  value 10k  [RES0603]  (hidden comment: Res)
R78  value 63.4  [RES0603]  (hidden comment: Res)
R79  value 63.4  [RES0603]  (hidden comment: Res)
R80  value 27  [RES0603]  (hidden comment: Res)
R81  value 10k  [RES0603]  (hidden comment: Res)
R82  value 27  [RES0603]  (hidden comment: Res)
R83  value 10k  [RES0603]  (hidden comment: Res)
R84  value 10k  [RES0603]  (hidden comment: Res)
R85  value 60.4  [RES0603]  (hidden comment: Res)
R86  value 60.4  [RES0603]  (hidden comment: Res)
RX1  Color: Y  [LED0805]  (hidden comment: LED)
SBUS1  MOLEX-HDR-1x4-SHERLOCK_RA  [MOLEX-HDR-1X4-SHERLOCK-RA]  (value not drawn)
SBUS2  MOLEX-HDR-1x4-SHERLOCK_RA  [MOLEX-HDR-1X4-SHERLOCK-RA]  (value not drawn)
TE1  Color: Y  [LED0805]  (hidden comment: LED)
TERM1  Jumper  [HEADER_MALE_1X2]  (value not drawn)
TX1  Color: Y  [LED0805]  (hidden comment: LED)
U5  MCP9701  [MCP970X-E/TT]
U6  ISL83485  [ISL8348xIBZ]
U7  BMP180  [BMP180]
U8  STM32F103RET6  [STM32F103RxTx]  (parts A,B of 2)
U9  FT230XS  [FT230XS]
U10  636L3C008M  [636L3C]
URX1  Color: Y  [LED0805]  (hidden comment: LED)
USB  UX60SC-MB-5ST  [UX60SC-MB-5ST]  (value not drawn)
UTX1  Color: Y  [LED0805]  (hidden comment: LED)

### Ports
15V_EN (out), BAT_BAL[8..1] (out), BAT_CVH (in), BAT_CVL (in), BAT_CVSELA (out), BAT_CVSELB (out), BAT_I (in), BAT_SENS_EN (out), BAT_V (in), BOOST_H (out), BOOST_L (out), BUCK_H (out), BUCK_L (out), DISCHARGE_EN (out), ISENS_3V3_~{EN} (out), RAIL_I (in), RAIL_V (in)

### Nets
3V3: BTEMP.1 C21.2(B) C23.2(B) C24.2(B) C25.1(A) C31.1(A) C32.1(A) C33.1(A) C34.1(A) C35.1(A) C36.1(A) C39.1(A) FB2.2(B) GP1.A GP2.A P1.1(3V3) Q27.S R62.1(A) R64.1(A) R65.1(A) R67.1(A) R68.1(A) R69.1(A) R70.1(A) R74.1(A) R75.1(A) R76.1(A) R77.1(A) R81.1(A) U5.1(VDD) U6.8(VCC) U7.2(VDD) U7.3(VDDIO) U8.1(VBAT) U8.19(VDD1) U8.32(VDD2) U8.48(VDD3) U8.64(VDD4) U10.4(VCC)
5V: Q28.S Q29.S R61.1(A)
15V: D3.A
GND: BTEMP.3 C19.2(B) C20.2(B) C21.1(A) C22.2(B) C23.1(A) C24.1(A) C25.2(B) C26.2(B) C27.2(B) C28.2(B) C29.2(B) C30.2(B) C31.2(B) C32.2(B) C33.2(B) C34.2(B) C35.2(B) C36.2(B) C37.2(B) C38.2(B) C39.2(B) EXTLED.4 FAN.2 HALL.4 P1.3(GND) Q30.S R66.2(B) R71.2(B) R72.2(B) R83.2(B) R84.1(A) SBUS1.3 SBUS2.3 U5.3(GND) U6.5(GND) U7.7(GND) U8.6(OSC_OUT) U8.12(VSSA) U8.18(VSS1) U8.31(VSS2) U8.47(VSS3) U8.63(VSS4) U9.5(GND) U9.13(GND) U10.2(GND) USB.5(GND) USB.SHD
U3V3: C30.1(A) R78.1(A) R79.1(A) U9.3(VCCIO) U9.10(3V3OUT) U9.11(RESET#)
15V_EN: U8.8(PC0) ; port 15V_EN
BAT_BAL1: U8.40(PC9)  [project net BAL1]
BAT_BAL2: U8.39(PC8)  [project net BAL2]
BAT_BAL3: U8.38(PC7)  [project net BAL3]
BAT_BAL4: U8.37(PC6)  [project net BAL4]
BAT_BAL5: U8.58(PB6)  [project net BAL5]
BAT_BAL6: U8.59(PB7)  [project net BAL6]
BAT_BAL7: U8.61(PB8)  [project net BAL7]
BAT_BAL8: U8.62(PB9)  [project net BAL8]
BAT_CVH: U8.26(PB0) ; port BAT_CVH
BAT_CVL: U8.27(PB1) ; port BAT_CVL
BAT_CVSELA: U8.43(PA10) ; port BAT_CVSELA
BAT_CVSELB: U8.44(PA11) ; port BAT_CVSELB
BAT_I: U8.24(PC4) ; port BAT_I
BAT_SENS_EN: U8.45(PA12) ; port BAT_SENS_EN
BAT_V: U8.21(PA5) ; port BAT_V
BOOST_H: U8.41(PA8) ; port BOOST_H
BOOST_L: U8.34(PB13) ; port BOOST_L
BOOT0: R83.1(A) U8.60(BOOT0)
BUCK_H: U8.42(PA9) ; port BUCK_H
BUCK_L: U8.35(PB14) ; port BUCK_L
BUZZER: Q30.G R66.1(A) U8.55(PB3)
CLK8MHZ: U8.5(OSC_IN) U10.3(OUTPUT)
CLK_EN: R84.2(B) U8.4(PC15) U10.1(EOH)
DEBUG_CTS: R77.2(B) U8.14(PA0) U9.6(CTS#)
DEBUG_RTS: R76.2(B) U8.15(PA1) U9.2(RTS#)
DEBUG_RXI: R74.2(B) U8.17(PA3) U9.1(TXD)
DEBUG_TXO: R75.2(B) U8.16(PA2) U9.4(RXD)
DISCHARGE_EN: U8.36(PB15) ; port DISCHARGE_EN
EXTLED_5V_~{EN}: Q28.G Q29.G R61.2(B) U8.50(PA15)
EXTLED_CLK: EXTLED.2 U8.56(PB4)
EXTLED_DATA: EXTLED.3 U8.57(PB5)
HALL_3V3_~{EN}: Q27.G R62.2(B) U8.11(PC3)
HALL_CHARGE: HALL.3 U8.23(PA7)
HALL_DISCHARGE: HALL.2 U8.22(PA6)
I2C_SCL: R69.2(B) U7.5(SCL) U8.29(PB10)
I2C_SDA: R70.2(B) U7.6(SDA) U8.30(PB11)
ISENS_3V3_~{EN}: U8.33(PB12) ; port ISENS_3V3_~{EN}
LED1: R85.2(B) U8.28(PB2/BOOT1)
LED2: R86.2(B) U8.2(PC13)
NRST: P1.5(NRST) R81.2(B) U8.7(NRST)
RAIL_I: U8.25(PC5) ; port RAIL_I
RAIL_V: U8.20(PA4) ; port RAIL_V
SUBBUS_RE: R68.2(B) U6.2(~{RE}) U8.53(PC12)
SUBBUS_RXI: RX1.C U6.1(RO) U8.52(PC11)
SUBBUS_TE: R71.1(A) TE1.A U6.3(DE) U8.54(PD2)
SUBBUS_TXO: TX1.C U6.4(DI) U8.51(PC10)
SWCLK: P1.2(SWCLK) U8.49(PA14)
SWDIO: P1.4(SWDIO) U8.46(PA13)
SWO: P1.6(SWO)
TEMP_BAT: BTEMP.2 U8.9(PC1)
TEMP_FETS: U5.2(VOUT) U8.10(PC2)
WKUP: R67.2(B) SBUS1.4 SBUS2.4 U8.3(PC14)
NetBUZZER_1: BUZZER.1 Q30.D R63.2(B)
NetBUZZER_2: BUZZER.2 D3.C R63.1(A)
NetC19_1: C19.1(A) EXTLED.1 Q28.D
NetC20_1: C20.1(A) HALL.1 Q27.D
NetC22_1: C22.1(A) FAN.1 Q29.D
NetC26_1: C26.1(A) FB1.2(B) USB.1(VBUS)
NetC27_1: C27.1(A) R80.1(A) USB.2(D-)
NetC28_1: C28.1(A) R82.1(A) USB.3(D+)
NetC29_1: C29.1(A) FB1.1(A) U9.12(VCC)
NetC37_1: C37.1(A) C38.1(A) FB2.1(A) U8.13(VDDA)
NetGP1_C: GP1.C R85.1(A)
NetGP2_C: GP2.C R86.1(A)
NetR64_2: R64.2(B) RX1.A
NetR65_2: R65.2(B) TX1.A
NetR72_1: R72.1(A) TE1.C
NetR73_1: R73.1(A) TERM1.1
NetR73_2: R73.2(B) SBUS1.2 SBUS2.2 U6.6(A/Y)
NetR78_2: R78.2(B) URX1.A
NetR79_2: R79.2(B) UTX1.A
NetR80_2: R80.2(B) U9.9(USBDM)
NetR82_2: R82.2(B) U9.8(USBDP)
NetSBUS1_1: SBUS1.1 SBUS2.1 TERM1.2 U6.7(B/Z)
NetU9_7: U9.7(CBUS2) UTX1.C
NetU9_14: U9.14(CBUS1) URX1.C

Not connected (* = marked no-connect by the designer): U7 1(CSB) 4(SDO); U9 15(CBUS0) 16(CBUS3); USB 4(ID)

### Buses and harness runs
bus BAT_BAL[8..1]
bus BAT_BAL[8..1] = port BAT_BAL[8..1]

### Notes on the sheet
- D6 exists to prevent backfeeding when we wire multiple boards to one buzzer.
- (near R67) Warning: These SBUS grounds should only be used during development situations where a common ground isn't already created through VRAIL. In the vehicle, connecting ground to these pins will create a ground loop!
- (near R71) TODO: Reposition on board better
- Place jumper when SBUS2 is unused for proper RS485 termination.
- Title
- Size:
- Date:
- A3
- Number:
- Time:
- Revision:
- Sheet
- of
- File:

### Library data of the parts
BTEMP = MOLEX-HDR-1x3-SHERLOCK_RA: Header, Molex, 2mm Pitch Sherlock Header, Single Row, Right Angle 3 Circuits, Length 3.3mm; Manufacturer Part Number: 35363-0360; Manufacturer: Molex Connector Corporation; Supplier Part Number: WM18932-ND; Supplier: Digi-Key
BUZZER = MOLEX-HDR-1x2-SHERLOCK_RA: Header, Molex, 2mm Pitch Sherlock Header, Single Row, Horizontal, 2 Circuits, Length 3.3mm,  0353630260; Manufacturer: Molex Inc; Manufacturer Part Number: 0353630260; Supplier Part Number: WM18931-ND; Supplier: Digi-Key
C39 = Cap: Manufacturer: Kemet; Manufacturer PN: C0603C104K8RACTU; Distributor: Digikey; Distributor PN: 399-1095-1-ND; Supplier 1: Digi-Key; Supplier Part Number 1: 1276-1000-1-ND
D3 = DFLS160: as D4 on sheet Power; Supplier 1: Digi-Key; Supplier Part Number 1: DFLS160DICT-ND
EXTLED SBUS1 SBUS2 = MOLEX-HDR-1x4-SHERLOCK_RA: Header, Molex, 2mm Pitch Sherlock Header, Single Row, Horizontal, 4 Circuits, Length 3.3mm; Manufacturer Part Number: 0353630460; Supplier Part Number: WM18933-ND; Manufacturer: Molex; Supplier: Digikey
FAN = MOLEX-HDR-1x2-SHERLOCK_VERT: Header, Molex, 2mm Pitch Sherlock Header, Single Row, Vertical, 2 Circuits, Length 3.3mm, 0353620250; Manufacturer Part Number: *; Order Part Number: *
FB1 FB2 = FBead: Ferrite Bead; Supplier 1: Digi-Key; Supplier Part Number 1: 445-2988-1-ND
HALL = MOLEX-HDR-1x4-SHERLOCK_VERT: Header, Molex, 2mm Pitch Sherlock Header, Single Row, Vertical, 4 Circuits, Length 3.3mm, 0353620450; Manufacturer Part Number: *; Order Part Number: *
P1 = SWD_STM32: SWD connector matching the pinout on STM Discovery Boards
Q27-Q29 = FDN5618P: as Q37 on sheet Top; Supplier 1: Digi-Key; Supplier Part Number 1: FDN5618PCT-ND
Q30 = FDN5630: 60V N-Channel PowerTrench MOSFET; Supplier 1: Digi-Key; Supplier Part Number 1: FDN5630CT-ND
TERM1 = Jumper: Single Jumper on 1x2 Male Header
U5 = MCP970x: Low-Power Linear Active Thermistor ICs; Supplier 1: Digi-Key; Supplier Part Number 1: MCP9701AT-E/TTCT-ND
U6 = ISL83485: 3.3V RS485 Transceiver; Supplier 1: Digi-Key; Supplier Part Number 1: ISL83485IBZ-ND
U7 = BMP180: Digital Pressure Sensor; Supplier 1: Digi-Key; Supplier Part Number 1: 828-1027-1-ND
U8 = STM32F103RET6: Mainstream Performance line, ARM Cortex-M3 MCU
U9 = FT230XS: USB To Basic UART IC; Supplier 1: Digi-Key; Supplier Part Number 1: 768-1154-5-ND
U10 = 636L3C: HCMOS/TTL Clock Oscillator; Supplier 1: Digi-Key; Supplier Part Number 1: CTX1005CT-ND
USB = UX60SC-MB-5ST: USB Mini B Metal Shield SMT; Supplier 1: Digi-Key; Supplier Part Number 1: H11671CT-ND
C19-C38 = Cap
  C19 C22 C38: Supplier 1: Digi-Key; Supplier Part Number 1: 1276-1029-1-ND
  C20: Supplier 1: Digi-Key; Supplier Part Number 1: 399-1095-1-ND
  C21 C23-C25 C29-C34 C36: Supplier 1: Digi-Key; Supplier Part Number 1: 1276-1000-1-ND
  C26: Supplier 1: Digi-Key; Supplier Part Number 1: 445-1311-1-ND
  C27 C28: Supplier 1: Digi-Key; Supplier Part Number 1: 445-1277-1-ND
  C35: Supplier 1: Digi-Key; Supplier Part Number 1: 1276-2876-1-ND
GP1 GP2 RX1 TE1 TX1 URX1 UTX1 = LED: Supplier 1: Digi-Key
  GP1 GP2: Supplier Part Number 1: 475-1410-1-ND
  RX1 TE1 TX1 URX1 UTX1: Supplier Part Number 1: 160-1416-1-ND
R61-R86 = Res: Supplier 1: Digi-Key
  R61 R62 R66-R68 R71 R74-R77 R81 R83 R84: Supplier Part Number 1: RMCF0603JT10K0CT-ND
  R63: Supplier Part Number 1: RMCF0603JT2K00CT-ND
  R64 R65 R72 R78 R79: Supplier Part Number 1: RMCF0603FT63R4CT-ND
  R69 R70: Supplier Part Number 1: RMCF0603JT4K70CT-ND
  R73: Supplier Part Number 1: RHM120HCT-ND
  R80 R82: Supplier Part Number 1: RMCF0603JT27R0CT-ND
  R85 R86: Supplier Part Number 1: RMCF0603FT60R4CT-ND

## Nets that join several sheets
3V3: Top (Q37.S R96.1), Battery (C2.1 U2.16), Power (C45.1 U14.2), CPU (39 pins)
5V: Power (6 pins), CPU (Q28.S Q29.S R61.1)
15V: Power (C48.1 U15.1), Charge (C15.1 C16.1 U3.1 U4.1), CPU (D3.A)
GND: Battery (47 pins), Rail (8 pins), Power (14 pins), Discharge (6 pins), Charge (9 pins), CPU (48 pins)
15V_EN: Power (Q36.G R93.1), CPU (U8.8)
BAL1: Battery (R10.1), CPU (U8.40)
BAL2: Battery (R11.1), CPU (U8.39)
BAL3: Battery (R12.1), CPU (U8.38)
BAL4: Battery (R13.1), CPU (U8.37)
BAL5: Battery (R30.1), CPU (U8.58)
BAL6: Battery (R31.1), CPU (U8.59)
BAL7: Battery (R32.1), CPU (U8.61)
BAL8: Battery (R33.1), CPU (U8.62)
BAT+: Battery (6 pins), Power (D6.A), Discharge (C40.2 Q31.D Q32.D U11.1), Charge (C14.1 D1.C Q24.D)
BAT_CVH: Battery (U2.3), CPU (U8.26)
BAT_CVL: Battery (U2.13), CPU (U8.27)
BAT_CVSELA: Battery (U2.10), CPU (U8.43)
BAT_CVSELB: Battery (U2.9), CPU (U8.44)
BAT_I: Battery (U1.12), CPU (U8.24)
BAT_SENS_EN: Battery (Q2.G Q13.G Q22.G R5.1), CPU (U8.45)
BAT_V: Battery (C4.1 R3.2 R4.1), CPU (U8.21)
BOOST_H: Charge (U4.5), CPU (U8.41)
BOOST_L: Charge (U4.6), CPU (U8.34)
BUCK_H: Charge (U3.5), CPU (U8.42)
BUCK_L: Charge (U3.6), CPU (U8.35)
DISCHARGE_EN: Discharge (R87.1 U11.2), CPU (U8.36)
ISENS_3V3_~{EN}: Top (Q37.G R96.2), CPU (U8.33)
NetC1_1: Top (Q37.D), Battery (C1.1 U1.14), Rail (C49.1 U16.14)
RAIL+: Rail (5 pins), Power (D4.A), Discharge (Q33.D Q34.D U12.1 U12.6), Charge (C13.1 Q23.D)
RAIL_I: Rail (U16.12), CPU (U8.25)
RAIL_V: Rail (C51.1 R94.2 R95.1), CPU (U8.20)